# EAGLE design tick-box-1591A-mk-1.0 (EAGLE 6.5.0)
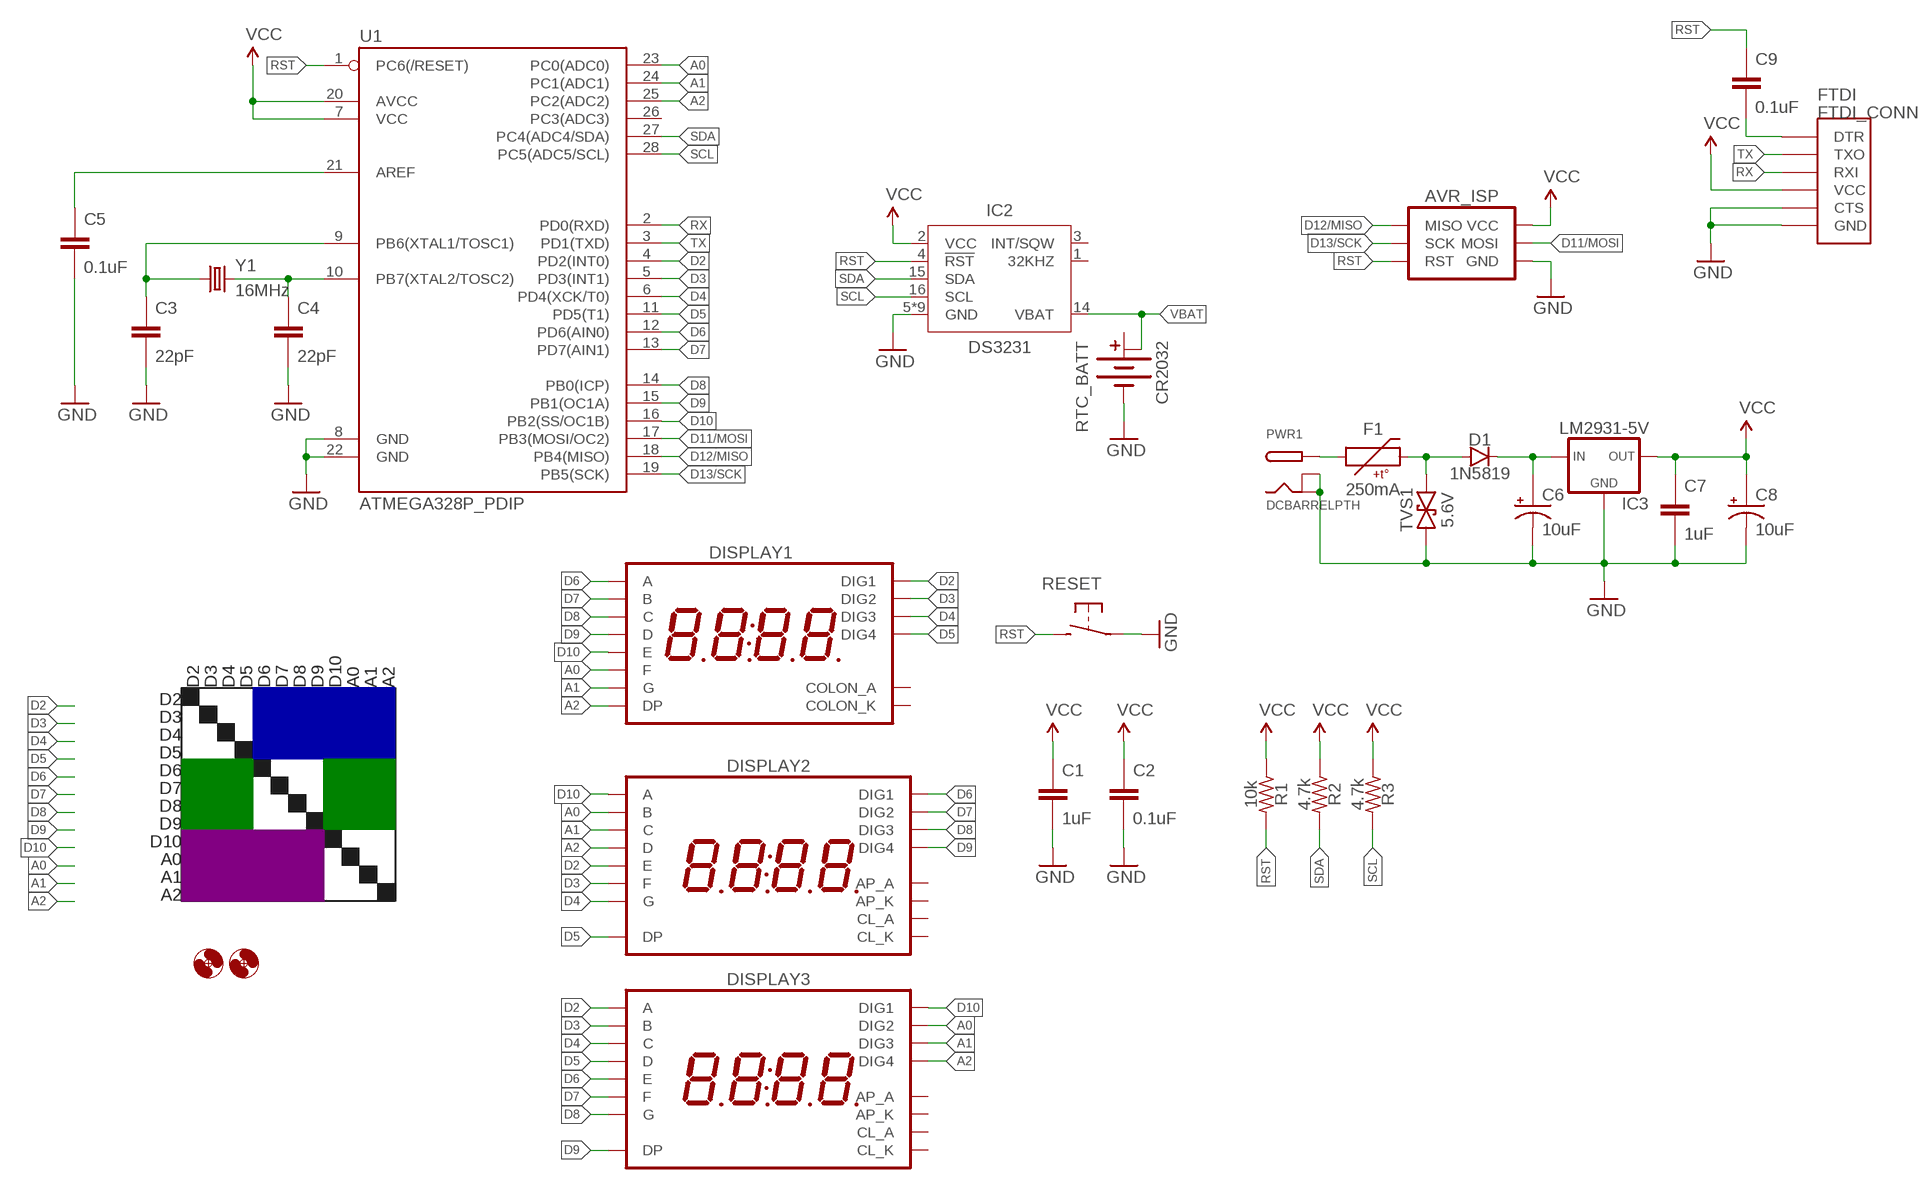
[diagram p0: schematic, sheet 1]

## Parts
AVR_ISP  AVR_SPI_PRG_6PTH  [2X3]
C1  1uF  CAPACITOR-CERAMIC025-024X044  [C025-024X044]
C2  0.1uF  CAPACITOR-CERAMIC025-024X044  [C025-024X044]
C3  22pF  CAPACITOR-CERAMIC025-024X044  [C025-024X044]
C4  22pF  CAPACITOR-CERAMIC025-024X044  [C025-024X044]
C5  0.1uF  CAPACITOR-CERAMIC025-024X044  [C025-024X044]
C6  10uF  CAPACITOR-POLARIZEDE2-5  [E2-5]
C7  1uF  CAPACITOR-CERAMIC025-024X044  [C025-024X044]
C8  10uF  CAPACITOR-POLARIZEDE2-5  [E2-5]
C9  0.1uF  CAPACITOR-CERAMIC025-024X044  [C025-024X044]
D1  1N5819  DIODEPTH-10.68MM  [DIODE-10.16MM]
DISPLAY1  7SEG_4DIGIT_COLON14.2MM-CC-NS  [7SEG_4DIG_NS]
DISPLAY2  7SEG_4DIGIT_COLON_APOS  [7SEG_4DIG_10MM]
DISPLAY3  7SEG_4DIGIT_COLON_APOS  [7SEG_4DIG_10MM]
F1  250mA  PTCPTH-5.08MM  [PTC-PTH-5.08MM]
FTDI  FTDI_CONN  [FTDI_CONN]
H1  HOLE#2  [HOLE-#2]
H2  HOLE#2  [HOLE-#2]
IC2  DS3231  [SO16W]
IC3  LM2931-5V  V_REG_78XXTO-92-INLINE  [TO-92-AMMO]
PWR1  DCBARRELPTH  [DCJACK_2MM_PTH]
R1  10k  RESISTORPTH-AXIAL-7.62MM  [RESISTOR-AXIAL-PTH-7.62MM]
R2  4.7k  RESISTORPTH-AXIAL-7.62MM  [RESISTOR-AXIAL-PTH-7.62MM]
R3  4.7k  RESISTORPTH-AXIAL-7.62MM  [RESISTOR-AXIAL-PTH-7.62MM]
RESET  SPST-NO-TACT6MM-PTH-SMALL-PADS  [DTS-6-SMALL-PADS]
RTC_BATT  CR2032  BATTERY-COINCR2032_SMD  [BATTCON_20MM_MINE]
TVS1  5.6V  TVSDO-41-TVS-BIDIRECTIONAL  [DO-41-TVS]
U1  ATMEGA328P_PDIP  [DIL28-3]
Y1  16MHz  CRYSTALHC49UV  [HC49U-V]

## Nets
A0: DISPLAY1.P$12(F) DISPLAY2.16(B) DISPLAY3.2(DIG2) U1.23(PC0(ADC0))
A1: DISPLAY1.P$5(G) DISPLAY2.13(C) DISPLAY3.6(DIG3) U1.24(PC1(ADC1))
A2: DISPLAY1.P$3(DP) DISPLAY2.3(D) DISPLAY3.8(DIG4) U1.25(PC2(ADC2))
D2: DISPLAY1.P$14(DIG1) DISPLAY2.5(E) DISPLAY3.14(A) U1.4(PD2(INT0))
D3: DISPLAY1.P$11(DIG2) DISPLAY2.11(F) DISPLAY3.16(B) U1.5(PD3(INT1))
D4: DISPLAY1.P$10(DIG3) DISPLAY2.15(G) DISPLAY3.13(C) U1.6(PD4(XCK/T0))
D5: DISPLAY1.P$6(DIG4) DISPLAY2.7(DP) DISPLAY3.3(D) U1.11(PD5(T1))
D6: DISPLAY1.P$13(A) DISPLAY2.1(DIG1) DISPLAY3.5(E) U1.12(PD6(AIN0))
D7: DISPLAY1.P$9(B) DISPLAY2.2(DIG2) DISPLAY3.11(F) U1.13(PD7(AIN1))
D8: DISPLAY1.P$4(C) DISPLAY2.6(DIG3) DISPLAY3.15(G) U1.14(PB0(ICP))
D9: DISPLAY1.P$2(D) DISPLAY2.8(DIG4) DISPLAY3.7(DP) U1.15(PB1(OC1A))
D10: DISPLAY1.P$1(E) DISPLAY2.14(A) DISPLAY3.1(DIG1) U1.16(PB2(SS/OC1B))
D11/MOSI: AVR_ISP.4(MOSI) U1.17(PB3(MOSI/OC2))
D12/MISO: AVR_ISP.1(MISO) U1.18(PB4(MISO))
D13/SCK: AVR_ISP.3(SCK) U1.19(PB5(SCK))
GND: AVR_ISP.6(GND) C1.2 C2.2 C3.2 C4.2 C5.2 C6.- C7.2 C8.- FTDI.CTS FTDI.GND IC2.5(GND) IC2.6(GND) IC2.7(GND) IC2.8(GND) IC2.9(GND) IC2.10(GND) IC2.11(GND) IC2.12(GND) IC2.13(GND) IC3.2(GND) PWR1.BRK PWR1.GND RESET.1 RESET.2 RTC_BATT.BOTTOM(-) TVS1.P$1 U1.8(GND) U1.22(GND)
N$1: C4.1 U1.10(PB7(XTAL2/TOSC2)) Y1.2
N$2: C3.1 U1.9(PB6(XTAL1/TOSC1)) Y1.1
N$3: C6.+ D1.C IC3.1(IN)
N$4: F1.P$1 PWR1.PWR
N$5: C5.1 U1.21(AREF)
N$6: D1.A F1.P$2 TVS1.P$2
N$9: C9.2 FTDI.DTR
RST: AVR_ISP.5(RST) C9.1 IC2.4(!RST) R1.P$2 RESET.3 RESET.4 U1.1(PC6(/RESET))
RX: FTDI.RXI U1.2(PD0(RXD))
SCL: IC2.16(SCL) R3.P$2 U1.28(PC5(ADC5/SCL))
SDA: IC2.15(SDA) R2.P$2 U1.27(PC4(ADC4/SDA))
TX: FTDI.TXO U1.3(PD1(TXD))
VBAT: IC2.14(VBAT) RTC_BATT.TOP@2(+1)
VCC: AVR_ISP.2(VCC) C1.1 C2.1 C7.1 C8.+ FTDI.VCC IC2.2(VCC) IC3.3(OUT) R1.P$1 R2.P$1 R3.P$1 U1.7(VCC) U1.20(AVCC)
Unconnected: DISPLAY1.P$7(COLON_K) DISPLAY1.P$8(COLON_A) DISPLAY2.4(CL_A) DISPLAY2.9(AP_K) DISPLAY2.10(AP_A) DISPLAY2.12(CL_K) DISPLAY3.4(CL_A) DISPLAY3.9(AP_K) DISPLAY3.10(AP_A) DISPLAY3.12(CL_K) IC2.1(32KHZ) IC2.3(INT/SQW) RTC_BATT.TOP@1(+) U1.26(PC3(ADC3))

## Notes on the sheet
- D2 | D3 | D4 | D5 | D6 | D7 | D8 | D9 | D10 | A0 | A1 | A2
- D2
- D3
- D4
- D5
- D6
- D7
- D8
- D9
- D10
- A0
- A1
- A2

## Library data of the parts
AVR_ISP = A_butts:AVR_SPI_PRG_6: AVR ISP 6 Pin This is the reduced ISP connector for AVR programming. Common on Arduino. This footprint will take up less PCB space and can be used with a 10-pin to 6-pin adapter such as SKU: BOB-08508 **Special note about "TEST_POINT" package. The stop mask is on the top side, so if you want your programming test points to be on the bottom of your board, make sure to place this package on the bottom side of the board. This also ensure that the orientation to program from the bottom side will be correct.
C1-C5 C7 C9 = A_butts:CAPACITOR-CERAMIC: CAPACITOR, European symbol
C6 C8 = A_butts:CAPACITOR-POLARIZED: POLARIZED CAPACITOR, American symbol
D1 = A_butts:DIODE: Diode These are standard reverse protection diodes and small signal diodes. SMA package can handle up to about 1A. SOD-323 can handle about 200mA. What the SOD-323 package when ordering, there are some mfgs out there that are 5-pin packages.
DISPLAY1 = A_butts:7SEG_4DIGIT_COLON
DISPLAY2 DISPLAY3 = A_butts:7SEG_4DIGIT_COLON_APOS
F1 = A_butts:PTC: Resettable Fuse PTC Resettable Fuse. Spark Fun Electronics SKU : COM-08357
FTDI = A_butts:FTDI_CONN: Connector which mates to FTDI basic or FTDI cable.
H1 H2 = A_butts:HOLE: MOUNTING HOLE with drill center marker
IC2 = A_butts:DS3231
IC3 = A_butts:V_REG_78XX: Voltage Regulator Standard 7805 5V regulator. IGO (Input Ground Output). Spark Fun Electronics SKU : COM-00107
PWR1 = A_butts:DCBARREL: 2.0mm DC Barrel Jack DCJACK_2MM_PTH - Through Hole Jack (4UConnector: 05537)
R1-R3 = A_butts:RESISTOR: RESISTOR, American symbol
RESET = A_butts:SPST-NO-TACT
RTC_BATT = A_butts:BATTERY-COIN
TVS1 = A_butts:TVS: Transient voltage suppressor- prevents ESD on inputs. Ignore package description- MBRA140 is NOT this type of part!!!
U1 = A_butts:ATMEGA328P_PDIP: uC used in the Arduino 32kb flash, 1k EEPROM, 2k SRAM This is the through-hole version of this chip.
Y1 = A_butts:CRYSTAL: Various standard crystals. Proven footprints. Spark Fun Electronics SKU : COM-00534

## Board
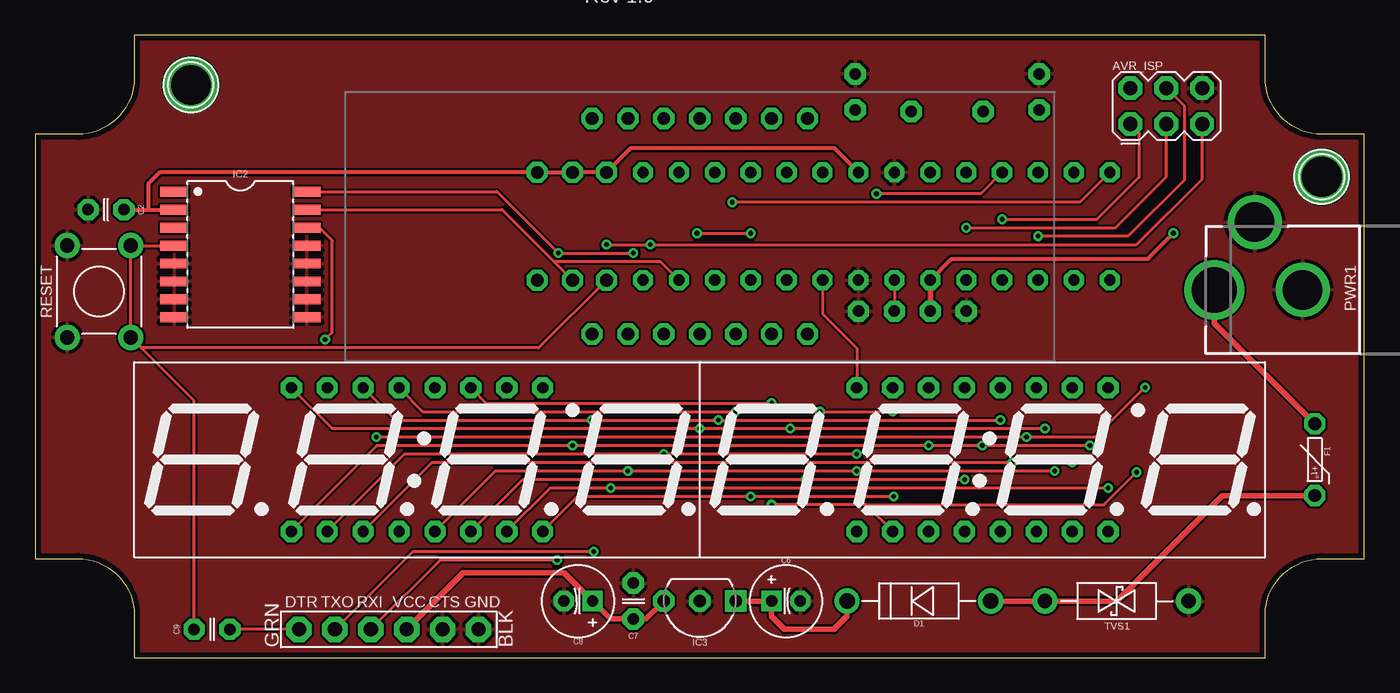
[diagram p1: board, top side]
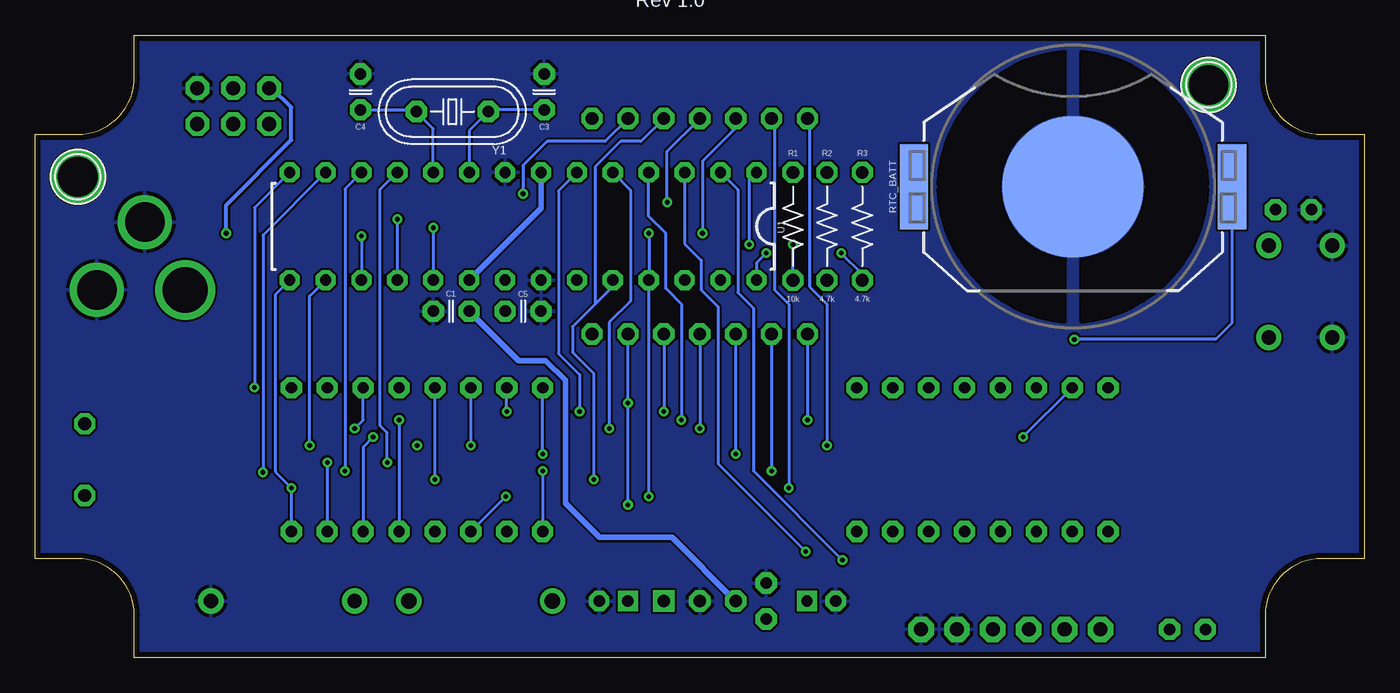
[diagram p2: board, bottom side, seen from below]

Size 94 x 44 mm. Coordinates in mm from the lower left corner, seen from the top.
Outline: 87,44 7,44 7,41 arc-90 3,37 0,37 0,7 3,7 arc-90 7,3 7,0 87,0 87,3 arc-90 91,7 94,7 94,37 91,37 arc-90 87,41 87,44
Copper layers (1*16): Top 0.0356mm / dielectric 1.5011mm / Bottom 0.0356mm
Design rules "LaenPCBOrder_2": minimum track width 6mil, minimum drill 13mil, track to track 6mil, track to pad 6mil, pad to pad 6mil, via to via 6mil, smd to smd 6mil, copper to edge 15mil, drill to drill 6mil, minimum pad ring 7mil, minimum via ring 7mil, stop-mask expansion 3mil, vias tented up to drill 20mil, thermal gap 10mil

### Footprints (pad centres in the part's own frame; a part is rotated, then mirrored left to right if it is on the bottom)
2X3 = drill 1 pad 1.676 octagon: 1 -2.54,-1.27; 2 -2.54,1.27; 3 0,-1.27; 4 0,1.27; 5 2.54,-1.27; 6 2.54,1.27
C025-024X044 = drill 0.813 pad 1.5 octagon: 1 -1.27,0; 2 1.27,0
E2-5 = drill 0.813 pad 1.422 square: + -1.016,0 | drill 0.813 pad 1.422 octagon: - 1.016,0
DIODE-10.16MM = drill 1.1 pad 1.778: A -5.08,0; C 5.08,0
7SEG_4DIG_NS = drill 0.9 pad 1.5 octagon: P$1 -7.62,7.62; P$2 -5.08,7.62; P$3 -2.54,7.62; P$4 0,7.62; P$5 2.54,7.62; P$6 5.08,7.62; P$7 7.62,7.62; P$8 7.62,-7.62; P$9 5.08,-7.62; P$10 2.54,-7.62; P$11 0,-7.62; P$12 -2.54,-7.62; P$13 -5.08,-7.62; P$14 -7.62,-7.62
7SEG_4DIG_10MM = drill 0.8 pad 1.5 octagon: 1 -8.89,-5.08; 2 -6.35,-5.08; 3 -3.81,-5.08; 4 -1.27,-5.08; 5 1.27,-5.08; 6 3.81,-5.08; 7 6.35,-5.08; 8 8.89,-5.08; 9 8.89,5.08; 10 6.35,5.08; 11 3.81,5.08; 12 1.27,5.08; 13 -1.27,5.08; 14 -3.81,5.08; 15 -6.35,5.08; 16 -8.89,5.08
PTC-PTH-5.08MM = drill 0.9 pad 1.5 octagon: P$1 -2.54,0; P$2 2.54,0
FTDI_CONN = drill 1 pad 1.8 octagon: CTS 3.81,0; DTR -6.35,0; GND 6.35,0; RXI -1.27,0; TXO -3.81,0; VCC 1.27,0
HOLE-#2 = drill 2.8 pad 3.81: P$1 0,0
SO16W = smd 0.7 x 2: 1 -4.445,-4.685; 2 -3.175,-4.685; 3 -1.905,-4.685; 4 -0.635,-4.685; 5 0.635,-4.685; 6 1.905,-4.685; 7 3.175,-4.685; 8 4.445,-4.685; 9 4.445,4.685; 10 3.175,4.685; 11 1.905,4.685; 12 0.635,4.685; 13 -0.635,4.685; 14 -1.905,4.685; 15 -3.175,4.685; 16 -4.445,4.685
TO-92-AMMO = drill 0.9 pad 1.5 square: 1 -2.54,0 | drill 0.9 pad 1.5 octagon: 2 0,0; 3 2.54,0
DCJACK_2MM_PTH = drill 2.8: BRK 4.8,10.75; GND 0,7.35 | drill 3.2: PWR 0,13.6
RESISTOR-AXIAL-PTH-7.62MM = drill 0.9 pad 1.5 octagon: P$1 -3.81,0; P$2 3.81,0
DTS-6-SMALL-PADS = drill 1 pad 1.778: 1 -3.25,2.25; 2 3.25,2.25; 3 -3.25,-2.25; 4 3.25,-2.25
BATTCON_20MM_MINE = smd 10 x 10: BOTTOM 0,0 | smd 6 x 2: TOP@1 0,11.25; TOP@2 0,-11.25
DO-41-TVS = drill 1 pad 1.778: P$1 -5.08,0; P$2 5.08,0
DIL28-3 = drill 0.8 pad 1.422 octagon: 1 -16.51,-3.81; 2 -13.97,-3.81; 3 -11.43,-3.81; 4 -8.89,-3.81; 5 -6.35,-3.81; 6 -3.81,-3.81; 7 -1.27,-3.81; 8 1.27,-3.81; 9 3.81,-3.81; 10 6.35,-3.81; 11 8.89,-3.81; 12 11.43,-3.81; 13 13.97,-3.81; 14 16.51,-3.81; 15 16.51,3.81; 16 13.97,3.81; 17 11.43,3.81; 18 8.89,3.81; 19 6.35,3.81; 20 3.81,3.81; 21 1.27,3.81; 22 -1.27,3.81; 23 -3.81,3.81; 24 -6.35,3.81; 25 -8.89,3.81; 26 -11.43,3.81; 27 -13.97,3.81; 28 -16.51,3.81
HC49U-V = drill 0.813 pad 1.524 octagon: 1 -2.54,0; 2 2.54,0

### Placement (x,y rotation side)
AVR_ISP  80,39 0 top
C1  64.58,24.5 180 bottom
C2  5,31.68 180 top
C3  58,40 90 bottom
C4  71,40 90 bottom
C5  59.5,24.5 0 bottom
C6  53.1,4 0 top
C7  42.3,4 90 top
C8  38.4,4 180 top
C9  12.5,2 0 top
D1  62.5,4 180 top
DISPLAY1  47,30.5 0 top
DISPLAY2  67,14 0 top
DISPLAY3  27,14 0 top
F1  90.5,14 270 top
FTDI  25,2 0 top
H1  11,40.5 0 top
H2  91,34 0 top
IC2  14.5,28.5 270 top
IC3  47,4 180 top
PWR1  97,26 90 top
R1  40.4,30.5 270 bottom
R2  38,30.5 270 bottom
R3  35.5,30.5 270 bottom
RESET  4.5,25.89 90 top
RTC_BATT  20.6,33.3 90 bottom
TVS1  76.5,4 180 top
U1  59.5,30.5 180 bottom
Y1  64.5,38.6 180 bottom

### Tracks (layer width: path | path; a pad name or v marks a point on that pad's centre or on a via)
A0  (via drill 0.33)
  Top 0.2: DISPLAY3.2 26.13,14.4 v44.46,14.4 v58.11,14.4 | U1.23 55.69,24.31 58.11,21.89 DISPLAY2.16
  Bottom 0.2: v58.11,14.4 DISPLAY2.16 | DISPLAY1.P$12 v44.46,14.4
A1  (via drill 0.33)
  Top 0.2: DISPLAY3.6 34.49,12.6 v54.5,12.6 v65.73,12.6
  Bottom 0.2: v65.73,12.6 DISPLAY2.13 | DISPLAY1.P$5 51.16,36.5 52.6,36.5 54.4,34.7 54.4,25 | 54.4,25 56,23.4 56,21.6 54.5,20.1 v54.5,12.6 | U1.24 53.15,26.25 54.4,25
A2  (via drill 0.33)
  Top 0.2: DISPLAY3.8 38.37,11.4 v50.61,11.4 v60.71,11.4 | v46.8,30 v50.6,30
  Bottom 0.2: v50.61,11.4 U1.25 v50.6,30 | v60.71,11.4 DISPLAY2.3 | DISPLAY1.P$3 44.46,37.44 46.8,35.1 v46.8,30
D2  (via drill 0.33)
  Top 0.2: DISPLAY3.14 25.47,16.8 v39.38,16.8 v48.3,16.8 v68.27,16.8
  Bottom 0.2: v68.27,16.8 DISPLAY2.5 | DISPLAY1.P$14 v39.38,16.8 | U1.4 50.61,31.21 49.4,30 49.4,26.1 48.3,25 v48.3,16.8
D3  (via drill 0.33)
  Top 0.2: DISPLAY3.16 20.99,16.2 v47,16.2 v53.4,16.2 v71.41,16.2
  Bottom 0.2: v71.41,16.2 70.81,16.8 DISPLAY2.11 | DISPLAY1.P$11 v47,16.2 | U1.5 51.9,33.06 51.9,25.2 53.4,23.7 v53.4,16.2
D4  (via drill 0.33)
  Top 0.2: DISPLAY3.13 27.41,17.4 v49.54,17.4 v55.5,17.4 v60.65,17.4
  Bottom 0.2: v60.65,17.4 DISPLAY2.15 | DISPLAY1.P$10 v49.54,17.4 | v55.5,17.4 55.5,20 57,21.5 57,33 U1.6
D5  (via drill 0.33)
  Top 0.2: DISPLAY3.3 28.07,13.8 v69.1,13.8 v73.35,13.8 | U1.11 66.88,32.8 v59.5,32.8
  Bottom 0.2: v73.35,13.8 DISPLAY2.7 | v69.1,13.8 69.1,15.9 69.6,16.4 69.6,33.1 U1.11 | DISPLAY1.P$6 53.7,36.5 57.8,36.5 59.5,34.8 v59.5,32.8
D6  (via drill 0.33)
  Top 0.2: DISPLAY3.5 32.55,13.2 v41.92,13.2 v58.11,13.2 v72.1,13.2
  Bottom 0.2: v58.11,13.2 DISPLAY2.1 | DISPLAY1.P$13 v41.92,13.2 | U1.12 72.1,33.14 v72.1,13.2
D7  (via drill 0.33)
  Top 0.2: DISPLAY3.11 31.89,18 v52.08,18 | 58.77,10.8 v52.08,10.8 | 58.77,10.8 75.6,10.8 v77.9,13.1 | 58.77,10.8 DISPLAY2.2
  Bottom 0.2: DISPLAY1.P$9 v52.08,18 v52.08,10.8 | U1.13 77.9,29.88 v77.9,13.1
D8  (via drill 0.33)
  Top 0.2: v24.13,15.6 v70.1,15.6 75,15.6 v78.5,19.1 | U1.14 73.9,32.2 v49.3,32.2
  Bottom 0.2: v70.1,15.6 70.81,14.89 DISPLAY2.6 | v24.13,15.6 DISPLAY3.15 | U1.14 78.5,31.82 v78.5,19.1 | v49.3,32.2 49.3,35.8 47,38.1 DISPLAY1.P$4
D9  (via drill 0.33)
  Top 0.2: DISPLAY3.7 36.43,12 v40.7,12 v75.89,12
  Bottom 0.2: DISPLAY2.8 v75.89,12 77,13.11 77,25.7 U1.15 | DISPLAY1.P$2 41.7,37.9 41.7,26 40.7,25 v40.7,12
D10  (via drill 0.33)
  Top 0.2: DISPLAY3.1 24.19,15 v38,15 v63.19,15 v67,15 v74.6,15
  Bottom 0.2: v63.19,15 DISPLAY2.14 | v38,15 38,25 39.2,26.2 39.2,37.94 DISPLAY1.P$1 | v74.6,15 74.6,25.56 U1.16
D11/MOSI  (via drill 0.33)
  Top 0.2: v70.93,29.8 77.3,29.8 81.3,33.8 81.3,38.97 AVR_ISP.4
  Bottom 0.2: v70.93,29.8 U1.17
D12/MISO  (via drill 0.33)
  Top 0.2: v68.39,31 75.1,31 78.1,34 78.1,37.09 AVR_ISP.1
  Bottom 0.2: U1.18 v68.39,31
D13/SCK  (via drill 0.33)
  Top 0.2: v65.85,30.4 76.4,30.4 80,34 AVR_ISP.3
  Bottom 0.2: v65.85,30.4 U1.19
GND
  pour Top: 7,0 7,3 arc90 3,7 0,7 0,37 3,37 arc90 7,41 7,44 87,44 87,41 arc90 91,37 94,37 94,7 91,7 arc90 87,3 87,0
  pour Bottom: 7,0 7,3 arc90 3,7 0,7 0,37 3,37 arc90 7,41 7,44 87,44 87,41 arc90 91,37 94,37 94,7 91,7 arc90 87,3 87,0
N$1
  Bottom 0.2: U1.10 65.85,37.41 Y1.2 67.17,38.73 C4.1
N$2
  Bottom 0.2: U1.9 63.31,37.25 Y1.1 61.83,38.73 C3.1
N$3
  Top 0.4: IC3.1 C6.+ | C6.+ 52.1,4 | C6.+ 52.08,2.92 53,2 56.5,2 57.42,2.92 D1.C
N$4
  Top 0.4: PWR1.PWR 83.4,23.64 F1.P$1
N$5
  Top 0.2: U1.21 C5.1
N$6
  Top 0.4: F1.P$2 83.96,11.46 76.5,4 TVS1.P$2 D1.A
N$9
  Top 0.2: FTDI.DTR C9.2
RST  (via drill 0.33)
  Top 0.2: RESET.3 RESET.4 IC2.4 | RESET.3 7.49,21.9 35.61,21.9 R1.P$2 | C9.1 11.23,18.16 RESET.3 | v40.4,29.2 v43.5,29.2 77.9,29.2 82.54,33.84 AVR_ISP.5
  Bottom 0.2: R1.P$2 v40.4,29.2 | U1.1 43.5,33.8 v43.5,29.2
RX  (via drill 0.33)
  Top 0.2: v36.9,6.9 28.63,6.9 FTDI.RXI
  Bottom 0.2: U1.2 44.3,33.08 44.3,25.8 43.2,24.7 43.2,13.2 v36.9,6.9
SCL  (via drill 0.33)
  Top 0.2: IC2.16 32.66,32.95 v37,28.6 v42.3,28.6
  Bottom 0.2: v37,28.6 35.5,27.1 R3.P$2 | v42.3,28.6 42.99,27.91 U1.28
SDA
  Top 0.2: IC2.15 33.02,31.68 36.7,28 | U1.27 44.22,28 36.7,28 | 36.7,28 R2.P$2
TX  (via drill 0.33)
  Top 0.2: v39.5,7.5 26.69,7.5 FTDI.TXO
  Bottom 0.2: U1.3 48.07,29.27 46.9,28.1 46.9,26 45.7,24.8 45.7,13.7 v39.5,7.5
VBAT  (via drill 0.33)
  Top 0.2: v20.5,22.5 21,23 21,29.5 20.09,30.41 IC2.14
  Bottom 0.2: RTC_BATT.TOP@2 9.35,23.65 10.5,22.5 v20.5,22.5
VCC  (via drill 0.33)
  Top 0.3: C2.1 8,31.68 | 8,31.68 IC2.2 | 8,31.68 8,33.5 8.81,34.31 R3.P$1 R2.P$1 R1.P$1 42.09,36 56.54,36 U1.7 | U1.20 64.82,28.2 78.7,28.2 v80.5,30
  Top 0.4: U1.20 C1.1 | IC3.3 43.19,2.73 C7.1 40.69,2.73 C8.+ 37.42,6 30.27,6 FTDI.VCC
  Bottom 0.3: v80.5,30 80.5,32 75.9,36.6 75.9,38.9 77.27,40.27 AVR_ISP.2
  Bottom 0.4: C1.1 59.81,21 57.9,21 56.5,19.6 56.5,10.9 54.1,8.5 48.96,8.5 IC3.3 | U1.7 58.23,31.77 U1.20